# Altium schematic sheet MCU.SchDoc
size A3; SheetNumber: 3; SheetTotal: 7
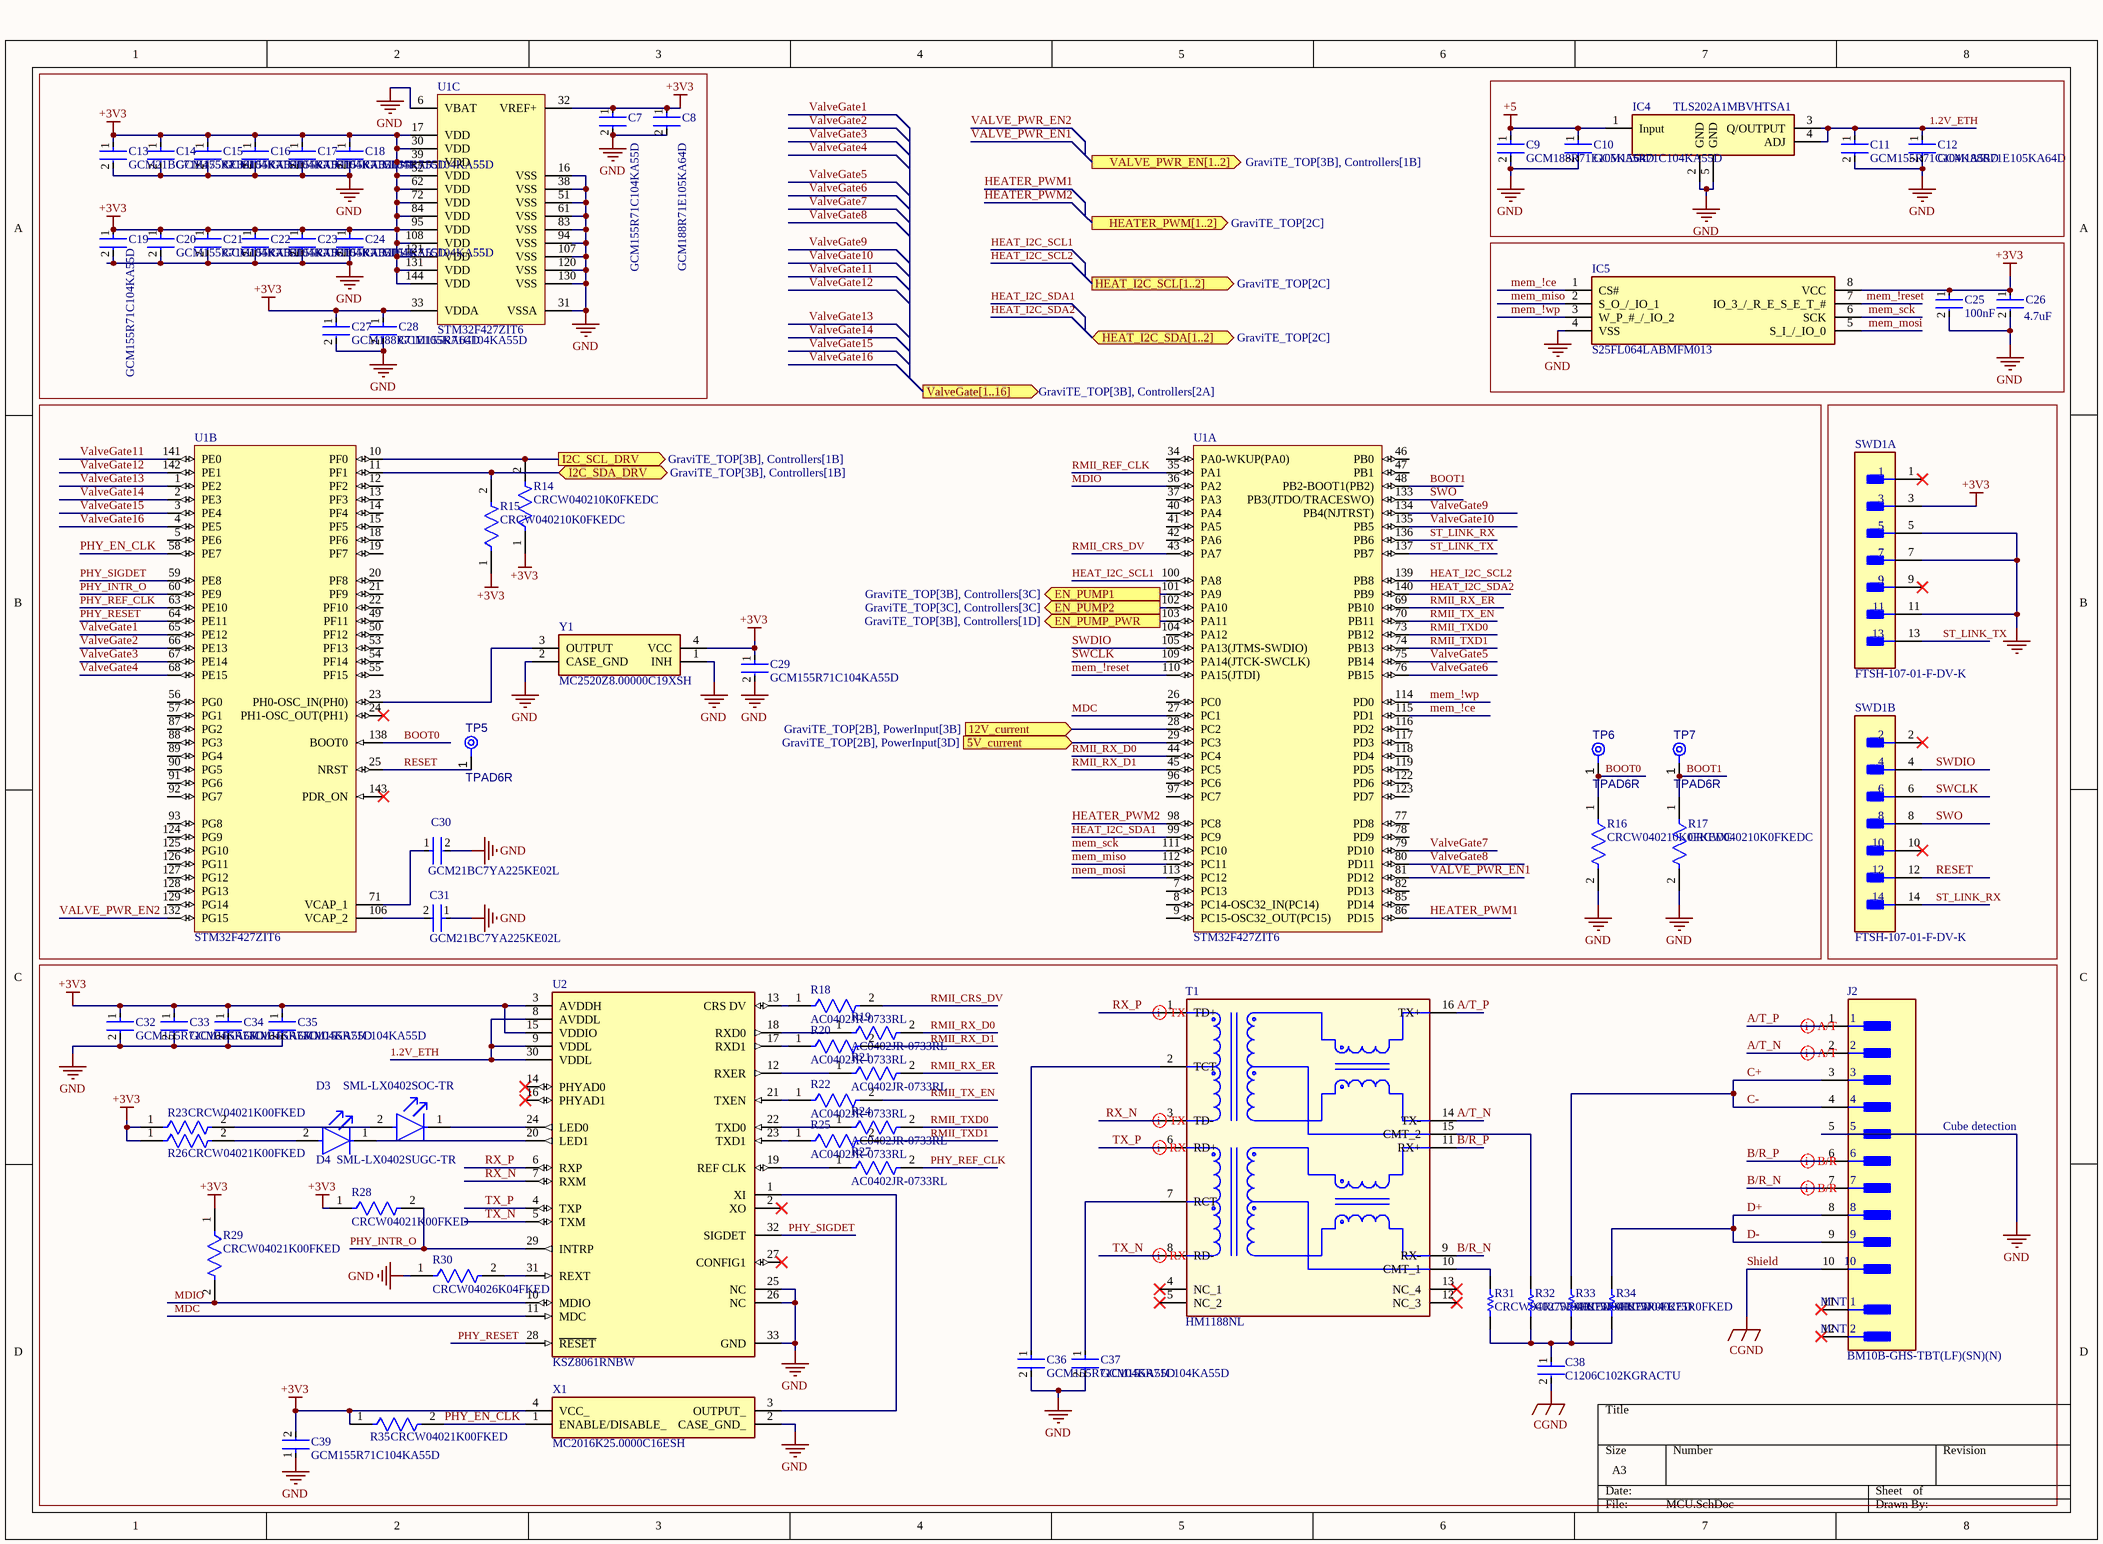
[diagram p0: MCU.SchDoc]

## Parts
C7  GCM155R71C104KA55D  [FP-GCM155-0_05-IPC_C]
C8  GCM188R71E105KA64D  [FP-GCM188-0_1-MFG]
C9  GCM188R71E105KA64D  [FP-GCM188-0_1-MFG]
C10  GCM155R71C104KA55D  [FP-GCM155-0_05-IPC_C]
C11  GCM155R71C104KA55D  [FP-GCM155-0_05-IPC_C]
C12  GCM188R71E105KA64D  [FP-GCM188-0_1-MFG]
C13  GCM21BC71E475KE36L  [FP-GCM21B-0_2-e0_2_0_7-IPC_C]
C14  GCM155R71C104KA55D  [FP-GCM155-0_05-IPC_C]
C15  GCM155R71C104KA55D  [FP-GCM155-0_05-IPC_C]
C16  GCM155R71C104KA55D  [FP-GCM155-0_05-IPC_C]
C17  GCM155R71C104KA55D  [FP-GCM155-0_05-IPC_C]
C18  GCM155R71C104KA55D  [FP-GCM155-0_05-IPC_C]
C19  GCM155R71C104KA55D  [FP-GCM155-0_05-IPC_C]
C20  GCM155R71C104KA55D  [FP-GCM155-0_05-IPC_C]
C21  GCM155R71C104KA55D  [FP-GCM155-0_05-IPC_C]
C22  GCM155R71C104KA55D  [FP-GCM155-0_05-IPC_C]
C23  GCM155R71C104KA55D  [FP-GCM155-0_05-IPC_C]
C24  GCM155R71C104KA55D  [FP-GCM155-0_05-IPC_C]
C25  100nF  [FP-GCM155-0_05-IPC_C]
C26  4.7uF  [FP-GCM21B-0_2-e0_2_0_7-IPC_C]
C27  GCM188R71E105KA64D  [FP-GCM188-0_1-MFG]
C28  GCM155R71C104KA55D  [FP-GCM155-0_05-IPC_C]
C29  GCM155R71C104KA55D  [FP-GCM155-0_05-IPC_C]
C30  GCM21BC7YA225KE02L  [FP-GCM21B-0_15-MFG]
C31  GCM21BC7YA225KE02L  [FP-GCM21B-0_15-MFG]
C32  GCM155R71C104KA55D  [FP-GCM155-0_05-IPC_C]
C33  GCM155R71C104KA55D  [FP-GCM155-0_05-IPC_C]
C34  GCM155R71C104KA55D  [FP-GCM155-0_05-IPC_C]
C35  GCM155R71C104KA55D  [FP-GCM155-0_05-IPC_C]
C36  GCM155R71C104KA55D  [FP-GCM155-0_05-IPC_C]
C37  GCM155R71C104KA55D  [FP-GCM155-0_05-IPC_C]
C38  C1206C102KGRACTU  [FP-C1206C-EF-MFG]
C39  GCM155R71C104KA55D  [FP-GCM155-0_05-IPC_C]
D3  SML-LX0402SOC-TR  [FP-SML-LX0402SOC-TR-MFG]
D4  SML-LX0402SUGC-TR  [FP-SML-LX0402SUGC-TR-MFG]
IC4  TLS202A1MBVHTSA1  [TLS202A1MBVHTSA1]
IC5  S25FL064LABMFM013  [SOIC127P800X216-8N]
J2  BM10B-GHS-TBT(LF)(SN)(N)  [FP-BM10B-GHS-TBT_LF_SN-MFG]
R14  CRCW040210K0FKEDC  [FP-CRCW0402-C-e3-IPC_C]
R15  CRCW040210K0FKEDC  [FP-CRCW0402-C-e3-IPC_C]
R16  CRCW040210K0FKEDC  [FP-CRCW0402-C-e3-IPC_C]
R17  CRCW040210K0FKEDC  [FP-CRCW0402-C-e3-IPC_C]
R18  AC0402JR-0733RL  [FP-AC0402-IPC_B]
R19  AC0402JR-0733RL  [FP-AC0402-IPC_B]
R20  AC0402JR-0733RL  [FP-AC0402-IPC_B]
R21  AC0402JR-0733RL  [FP-AC0402-IPC_B]
R22  AC0402JR-0733RL  [FP-AC0402-IPC_B]
R23  CRCW04021K00FKED  [FP-CRCW0402-e3-MFG]
R24  AC0402JR-0733RL  [FP-AC0402-IPC_B]
R25  AC0402JR-0733RL  [FP-AC0402-IPC_B]
R26  CRCW04021K00FKED  [FP-CRCW0402-e3-MFG]
R27  AC0402JR-0733RL  [FP-AC0402-IPC_B]
R28  CRCW04021K00FKED  [FP-CRCW0402-e3-MFG]
R29  CRCW04021K00FKED  [FP-CRCW0402-e3-MFG]
R30  CRCW04026K04FKED  [FP-CRCW0402-e3-IPC_A]
R31  CRCW040275R0FKED  [RESC1005X40X25NL05T05]
R32  CRCW040275R0FKED  [RESC1005X40X25NL05T05]
R33  CRCW040275R0FKED  [RESC1005X40X25NL05T05]
R34  CRCW040275R0FKED  [RESC1005X40X25NL05T05]
R35  CRCW04021K00FKED  [FP-CRCW0402-e3-MFG]
SWD1  FTSH-107-01-F-DV-K  [FP-FTSH-107-01-F-DV-K-MFG]  (parts A,B of 2)
T1  HM1188NL  [HM1188NL]
TP5  TPAD6R  [TP06R]  (no BOM)
TP6  TPAD6R  [TP06R]  (no BOM)
TP7  TPAD6R  [TP06R]  (no BOM)
U1  STM32F427ZIT6  [STM-LQFP144_V]  (parts A,B,C of 3)
U2  KSZ8061RNBW  [FP-QFN55-32LD-PL-5-IPC_A]
X1  MC2016K25.0000C16ESH  [MC2016K250000C16ESH]
Y1  MC2520Z8.00000C19XSH  [MC2520Z800000C19XSH]

## Blocks framed on the sheet
Cube detection: C32-C39 D3 D4 J2 R18-R35 T1 U2 X1

## Ports
5V_current (in, see GraviTE_TOP[2B], PowerInput[3D]), 12V_current (in, see GraviTE_TOP[2B], PowerInput[3B]), EN_PUMP1 (out, see GraviTE_TOP[3B], Controllers[3C]), EN_PUMP2 (out, see GraviTE_TOP[3C], Controllers[3C]), EN_PUMP_PWR (out, see GraviTE_TOP[3B], Controllers[1D]), HEAT_I2C_SCL[1..2] (out, see GraviTE_TOP[2C]), HEAT_I2C_SDA[1..2] (bidir, see GraviTE_TOP[2C]), HEATER_PWM[1..2] (out, see GraviTE_TOP[2C]), I2C_SCL_DRV (out, see GraviTE_TOP[3B], Controllers[1B]), I2C_SDA_DRV (bidir, see GraviTE_TOP[3B], Controllers[1B]), VALVE_PWR_EN[1..2] (out, see GraviTE_TOP[3B], Controllers[1B]), ValveGate[1..16] (out, see GraviTE_TOP[3B], Controllers[2A])

## Nets
+3V3: C7.1 C8.1 C13.1 C14.1 C15.1 C16.1 C17.1 C18.1 C19.1 C20.1 C21.1 C22.1 C23.1 C24.1 C25.1 C26.1 C27.1 C28.1 C29.1 C32.1 C33.1 C34.1 C35.1 C39.2 IC5.8(VCC) R14.1 R15.1 R23.1 R26.1 R28.1 R29.1 R35.1 SWD1.3 U1.17(VDD) U1.30(VDD) U1.32(VREF+) U1.33(VDDA) U1.39(VDD) U1.52(VDD) U1.62(VDD) U1.72(VDD) U1.84(VDD) U1.95(VDD) U1.108(VDD) U1.121(VDD) U1.131(VDD) U1.144(VDD) U2.3(AVDDH) U2.15(VDDIO) X1.4(VCC_) Y1.4(VCC)
+5: C9.1 C10.1 IC4.1(Input)
GND: C7.2 C8.2 C9.2 C10.2 C11.2 C12.2 C13.2 C14.2 C15.2 C16.2 C17.2 C18.2 C19.2 C20.2 C21.2 C22.2 C23.2 C24.2 C25.2 C26.2 C27.2 C28.2 C29.2 C30.2 C31.1 C32.2 C33.2 C34.2 C35.2 C36.2 C37.2 C39.1 IC4.2(GND) IC4.5(GND) IC5.4(VSS) J2.5 R16.2 R17.2 R30.1 SWD1.5 SWD1.7 SWD1.11 U1.6(VBAT) U1.16(VSS) U1.31(VSSA) U1.38(VSS) U1.51(VSS) U1.61(VSS) U1.83(VSS) U1.94(VSS) U1.107(VSS) U1.120(VSS) U1.130(VSS) U2.25(NC) U2.26(NC) U2.33(GND) X1.2(CASE_GND_) Y1.1(INH) Y1.2(CASE_GND)
Shield: C38.2 J2.10  [also labelled CGND]
1.2V_ETH: C11.1 C12.1 IC4.3(Q/OUTPUT) IC4.4(ADJ) U2.8(AVDDL) U2.9(VDDL) U2.30(VDDL)
5V_current: U1.29(PC3) ; port 5V_current
12V_current: U1.28(PC2) ; port 12V_current
A/T_N: J2.2 T1.14(TX-)
A/T_P: J2.1 T1.16(TX+)
B/R_N: J2.7 T1.9(RX-)
B/R_P: J2.6 T1.11(RX+)
BOOT0: R16.1 TP6.1(TP) U1.138(BOOT0)
BOOT1: R17.1 TP7.1(TP) U1.48(PB2-BOOT1(PB2))
C+: J2.3 J2.4 R33.2  [also labelled C-]
D+: J2.8 J2.9 R34.2  [also labelled D-]
EN_PUMP1: U1.101(PA9) ; port EN_PUMP1
EN_PUMP2: U1.102(PA10) ; port EN_PUMP2
EN_PUMP_PWR: U1.103(PA11) ; port EN_PUMP_PWR
HEAT_I2C_SCL1: U1.100(PA8)
HEAT_I2C_SCL2: U1.139(PB8)
HEAT_I2C_SDA1: U1.99(PC9)
HEAT_I2C_SDA2: U1.140(PB9)
HEATER_PWM1: U1.86(PD15)
HEATER_PWM2: U1.98(PC8)
I2C_SCL_DRV: R14.2 U1.10(PF0) ; port I2C_SCL_DRV
I2C_SDA_DRV: R15.2 U1.11(PF1) ; port I2C_SDA_DRV
MDC: U1.27(PC1) U2.11(MDC)
MDIO: R29.2 U1.36(PA2) U2.10(MDIO)
mem_!ce: IC5.1(CS#) U1.115(PD1)
mem_!reset: IC5.7(IO_3_/_R_E_S_E_T_#) U1.110(PA15(JTDI))
mem_!wp: IC5.3(W_P_#_/_IO_2) U1.114(PD0)
mem_miso: IC5.2(S_O_/_IO_1) U1.112(PC11)
mem_mosi: IC5.5(S_I_/_IO_0) U1.113(PC12)
mem_sck: IC5.6(SCK) U1.111(PC10)
PHY_EN_CLK: R35.2 U1.58(PE7) X1.1(ENABLE/DISABLE_)
PHY_INTR_O: R28.2 U1.60(PE9) U2.29(INTRP)
PHY_REF_CLK: R27.2 U1.63(PE10)
PHY_RESET: U1.64(PE11) U2.28(~{RESET})
PHY_SIGDET: U1.59(PE8) U2.32(SIGDET)
RESET: SWD1.12 TP5.1(TP) U1.25(NRST)
RMII_CRS_DV: R18.2 U1.43(PA7)
RMII_REF_CLK: U1.35(PA1)
RMII_RX_D0: R19.2 U1.44(PC4)
RMII_RX_D1: R20.2 U1.45(PC5)
RMII_RX_ER: R21.2 U1.69(PB10)
RMII_TX_EN: R22.2 U1.70(PB11)
RMII_TXD0: R24.2 U1.73(PB12)
RMII_TXD1: R25.2 U1.74(PB13)
RX_N: T1.3(TD-) U2.7(RXM)
RX_P: T1.1(TD+) U2.6(RXP)
ST_LINK_RX: SWD1.14 U1.136(PB6)
ST_LINK_TX: SWD1.13 U1.137(PB7)
SWCLK: SWD1.6 U1.109(PA14(JTCK-SWCLK))
SWDIO: SWD1.4 U1.105(PA13(JTMS-SWDIO))
SWO: SWD1.8 U1.133(PB3(JTDO/TRACESWO))
TX_N: T1.8(RD-) U2.5(TXM)
TX_P: T1.6(RD+) U2.4(TXP)
VALVE_PWR_EN1: U1.81(PD12)
VALVE_PWR_EN2: U1.132(PG15)
ValveGate1: U1.65(PE12)
ValveGate2: U1.66(PE13)
ValveGate3: U1.67(PE14)
ValveGate4: U1.68(PE15)
ValveGate5: U1.75(PB14)
ValveGate6: U1.76(PB15)
ValveGate7: U1.79(PD10)
ValveGate8: U1.80(PD11)
ValveGate9: U1.134(PB4(NJTRST))
ValveGate10: U1.135(PB5)
ValveGate11: U1.141(PE0)
ValveGate12: U1.142(PE1)
ValveGate13: U1.1(PE2)
ValveGate14: U1.2(PE3)
ValveGate15: U1.3(PE4)
ValveGate16: U1.4(PE5)
NetC30_1: C30.1 U1.71(VCAP_1)
NetC31_2: C31.2 U1.106(VCAP_2)
NetC36_1: C36.1 T1.2(TCT)
NetC37_1: C37.1 T1.7(RCT)
NetC38_1: C38.1 R31.1 R32.1 R33.1 R34.1
NetD3_1: D3.1(C) U2.24(LED0)
NetD3_2: D3.2(A) R23.2
NetD4_1: D4.1(C) U2.20(LED1)
NetD4_2: D4.2(A) R26.2
NetR18_1: R18.1 U2.13(CRS_DV)
NetR19_1: R19.1 U2.18(RXD0)
NetR20_1: R20.1 U2.17(RXD1)
NetR21_1: R21.1 U2.12(RXER)
NetR22_1: R22.1 U2.21(TXEN)
NetR24_1: R24.1 U2.22(TXD0)
NetR25_1: R25.1 U2.23(TXD1)
NetR27_1: R27.1 U2.19(REF_CLK)
NetR30_2: R30.2 U2.31(REXT)
NetR31_2: R31.2 T1.10(CMT_1)
NetR32_2: R32.2 T1.15(CMT_2)
NetU1_23: U1.23(PH0-OSC_IN(PH0)) Y1.3(OUTPUT)
NetU2_1: U2.1(XI) X1.3(OUTPUT_)

Not connected (* = marked no-connect by the designer): J2 11(MNT_1)* 12(MNT_2)*; SWD1 1* 2* 9* 10*; T1 4(NC_1)* 5(NC_2)* 12(NC_3)* 13(NC_4)*; U1 5(PE6) 7(PC13) 8(PC14-OSC32_IN(PC14)) 9(PC15-OSC32_OUT(PC15)) 12(PF2) 13(PF3) 14(PF4) 15(PF5) 18(PF6) 19(PF7) 20(PF8) 21(PF9) 22(PF10) 24(PH1-OSC_OUT(PH1))* 26(PC0) 34(PA0-WKUP(PA0)) 37(PA3) 40(PA4) 41(PA5) 42(PA6) 46(PB0) 47(PB1) 49(PF11) 50(PF12) 53(PF13) 54(PF14) 55(PF15) 56(PG0) 57(PG1) 77(PD8) 78(PD9) 82(PD13) 85(PD14) 87(PG2) 88(PG3) 89(PG4) 90(PG5) 91(PG6) 92(PG7) 93(PG8) 96(PC6) 97(PC7) 104(PA12) 116(PD2) 117(PD3) 118(PD4) 119(PD5) 122(PD6) 123(PD7) 124(PG9) 125(PG10) 126(PG11) 127(PG12) 128(PG13) 129(PG14) 143(PDR_ON)*; U2 2(XO)* 14(PHYAD0)* 16(PHYAD1)* 27(CONFIG1)*

## Layout directives
differential pair: A/T_N, A/T_P, B/R_N, B/R_P, RX_N, RX_P, TX_N, TX_P

## Library data of the parts
C7 C10 C11 C14-C25 C28 C29 C32-C37 C39 = CMP-2008-03711-3: Ceramic Capacitor for Automotive 100nF ±10% 16VDC X7R 0402 Paper T/R; Voltage Rating (DC): 16V; Termination: SMD/SMT; Length: 1mm; Voltage: 16V; Mount: Surface Mount; Packaging: Tape and Reel; Case Code (Metric): 1005; Case/Package: 0402; Voltage Rating: 16V; Min Operating Temperature: -55°C; Case Code (Imperial): 0402; Ratings: AEC-Q200; Height: 0.5mm; Tolerance: 10%; Width: 0.02inch; Radiation Hardening: No; Depth: 0.5mm; Capacitance: 100nF; Max Operating Temperature: 125°C; Package Quantity: 1; REACH SVHC: No SVHC; Thickness: 0.022inch; Dielectric: X7R; Lead Free: Lead Free
C8 C9 C12 C27 = CMP-2006-02363-4: Manufacturer Lifecycle Status: IN PRODUCTION; NexarPartId: 18909256; Dielectric: X7R; Material: Ceramic; Tolerance: 10%; Capacitance: 1µF; Voltage Rating: 25V; Thickness: 889µm; Max Operating Temperature: 125°C; Radiation Hardening: No; Weight: 6.293594mg; Lead Free: Lead Free; Mount: Surface Mount; Case Code (Imperial): 0603; REACH SVHC: No SVHC; Lifecycle Status: Production; Depth: 800µm; Min Operating Temperature: -55°C; Height: 800µm; Case Code (Metric): 1608; Case/Package: 0603; Voltage: 25V; Packaging: Cut Tape; Length: 1.6mm; Termination: SMD/SMT; Width: 787.4µm; Voltage Rating (DC): 25V; RoHS: Compliant; Schedule B: 8532240020, 8532240020; Ratings: AEC-Q200
C13 C26 = CMP-06035-049372-1: Ceramic Capacitor for Automotive 4.7uF ±10% 25VDC X7S 0805 Embossed T/R; Voltage Rating: 25V; Mount: Surface Mount; Case/Package: 0805; Case Code (Imperial): 0805; Tolerance: 10%; Max Operating Temperature: 125°C; Capacitance: 4.7uF; Packaging: Cut Tape; Min Operating Temperature: -55°C; Ratings: AEC-Q200; Case Code (Metric): 2012
C30 C31 = CMP-06035-026512-1: Ceramic Capacitor for Automotive 2.2uF ±10% 35VDC X7S 0805 Embossed T/R; Voltage Rating: 35V; Capacitance: 2.2uF; Case Code (Metric): 2012; Max Operating Temperature: 125°C; Min Operating Temperature: -55°C; Case Code (Imperial): 0805; Ratings: AEC-Q200; Packaging: Cut Tape; Mount: Surface Mount; Tolerance: 10%; Case/Package: 0805
C38 = CMP-03020-034681-1: CAP CER 1000PF 2KV X7R 1206; Tolerance: 10%; Capacitance: 1nF; Dissipation Factor: 2.5%; Dielectric Material: Ceramic; Voltage Rating (DC): 2.5kV; Voltage: 2kV; REACH SVHC: No SVHC; Height: 1.6mm; Construction: Flat; Case/Package: 1206; Series: C; Mount: Surface Mount; RoHS Compliant: Yes; Package Quantity: 1; Length: 3.2mm; Width: 0.063inch; Voltage Rating: 2kV; Min Operating Temperature: -55°C; Case Code (Metric): 3216; Termination: SMD/SMT; Number of Pins: 2; Case Code (Imperial): 1206; Packaging: Tape and Reel; Dielectric: X7R; Thickness: 0.069inch; Depth: 1.6mm; Radiation Hardening: No; Max Operating Temperature: 125°C
D3 = CMP-57192-000002-1: LED ORANGE CLEAR SMD; Forward Voltage: 2V; Viewing Angle: 120°; Luminous Intensity: 120mcd; Wavelength: 610nm; Forward Current: 20mA; Number of LEDs: 1; Lens Color: Colorless; Max Operating Temperature: 85°C; Mount: Surface Mount; Lens Transparency: Clear; Lens Style: Clear; Case Code (Metric): 1005; Length: 1mm; Package Quantity: 1; Case Code (Imperial): 0402; Color: Orange; Illumination Color: Orange; Width: 0.5mm; Packaging: Tape and Reel; Test Current: 20mA; Min Operating Temperature: -40°C; Height: 0.5mm; Number of Pins: 2; Lead Free: Lead Free; Case/Package: 0402
D4 = CMP-57192-000001-1: LED GREEN CLEAR SMD; Forward Voltage: 2.2V; Test Current: 20mA; Luminous Intensity: 45mcd; Lens Style: Diffused; Number of LEDs: 1; Approvals: UL; Lens Color: Colorless; Dominant Wavelength: 574nm; Viewing Angle: 120°; Lead Free: Lead Free; Case/Package: 0402; Number of Pins: 2; Width: 0.5mm; Min Operating Temperature: -40°C; Case Code (Imperial): 0402; Packaging: Tape and Reel; Color: Green; Max Operating Temperature: 85°C; Case Code (Metric): 1005; Mount: Surface Mount; Length: 1mm; Wavelength: 574nm; Height: 0.5mm; Illumination Color: Green; Lens Transparency: Clear; Package Quantity: 1; Forward Current: 20mA
IC4 = TLS202A1MBVHTSA1: Integrated Circuit; Manufacturer_Name: Infineon; Datasheet Link: https://www.infineon.com/dgdl/Infineon-TLS202A1MBV-DS-v01_00-EN.pdf?fileId=5546d46258fc0bc1015969d30cbf4211; Manufacturer_Part_Number: TLS202A1MBVHTSA1; Mouser Part Number: 726-TLS202A1MBVHTSA1; Mouser Price/Stock: https://www.mouser.co.uk/ProductDetail/Infineon-Technologies/TLS202A1MBVHTSA1?qs=0DP5yvOrqYl%252BugsjRWokhA%3D%3D
IC5 = S25FL064LABMFM013: Integrated Circuit; Manufacturer_Name: Infineon; Datasheet Link: https://www.arrow.com/en/products/s25fl064labmfm013/cypress-semiconductor; Height: 2.16mm; Manufacturer_Part_Number: S25FL064LABMFM013; Mouser Part Number: 727-S25FL064LAMFM013; Mouser Price/Stock: https://www.mouser.co.uk/ProductDetail/Infineon-Technologies/S25FL064LABMFM013?qs=HXFqYaX1Q2wJ3%252BtVnB80Jw%3D%3D; Arrow Part Number: S25FL064LABMFM013; Arrow Price/Stock: https://www.arrow.com/en/products/s25fl064labmfm013/cypress-semiconductor
J2 = CMP-17439-000269-1: CONN HEADER SMD 10POS 1.25MM; Mated Stacking Heights: 7.3mm; Number of Positions: 10; Voltage Rating: 50V; Packaging: Cut Tape; Contact Shape: Rectangular; Insulation Material: Nylon; Contact Type: Outer Shroud Contact; Contact Finish - Mating: TIN; Fastening Type: Ramp; Termination: Solder; Max Operating Temperature: 85°C; Min Operating Temperature: -25°C; Insulation Color: Natural; Number of Rows: 1; Flammability Rating: UL94 V-0; Contact Material: Bronze; Mount: Surface Mount; Series: GH; Connector Type: Header
R14-R17 = CMP-02407-012085-1: RES 10K OHM 1% 1/16W 0402; Temperature Coefficient: 100ppm/°C; Power Rating: 62.5mW; Resistance: 10kR; Lead Free: Lead Free; Max Operating Temperature: 155°C; RoHS Compliant: Yes; Mount: Surface Mount; Min Operating Temperature: -55°C; Termination: Wraparound; Length: 1mm; Resistor Type: Thick Film; Contact Plating: Tin; Tolerance: 1%; Case/Package: Molded
R18-R22 R24 R25 R27 = CMP-03412-045460-1: RES 33Ω ±5% 0.063W 0402; Resistance: 33R; Voltage Rating: 50V; Power Rating: 62.5mW; Temperature Coefficient: 100ppm/°C; Max Power Dissipation: 63mW; Width: 0.5mm; Max Operating Temperature: 155°C; Termination: SMD/SMT; Size Code: 0402; Lead Free: Lead Free; Series: AC; Case Code (Imperial): 0402; RoHS Compliant: Yes; Packaging: Tape and Reel; Features: Moisture Resistant; Case/Package: 0402; Height: 0.015inch; Length: 0.039inch; Number of Terminations: 2; Case Code (Metric): 1005; Tolerance: 5%; Min Operating Temperature: -55°C; Weight: 2.3E-05oz; Resistor Type: Thick Film
R23 R26 R28 R29 R35 = CMP-2002-08276-2: RES Thick Film, 1kΩ, 1%, 0.063W, 100ppm/°C, 0402; Resistance: 1kR; Power Rating: 63mW; Voltage Rating (DC): 50V; Package Quantity: 10; Termination: SMD/SMT; Width: 0.5mm; Military Standard: Not; Length: 1mm; Contact Plating: Tin; Mount: Surface Mount; Packaging: Tape and Reel; Case Code (Imperial): 0402; Tolerance: 1%; Weight: 2.3E-05oz; Number of Pins: 2; Case/Package: 0402; Case Code (Metric): 1005; Lead Free: Lead Free; Number of Terminations: 2; Max Power Dissipation: 63mW; Depth: 0.5mm; Temperature Coefficient: 100ppm/°C; Max Operating Temperature: 155°C; Height: 0.35mm; Features: Automotive AEC-Q200; Composition: Thick Film; Radiation Hardening: No; Voltage Rating: 50V; Min Operating Temperature: -55°C
R30 = CMP-1011-00598-3: RES Thick Film, 6.04kΩ, 1%, 0.063W, 100ppm/°C, 0402; Voltage Rating: 50V; Max Power Dissipation: 63mW; Resistance: 6.04kR; Number of Terminations: 2; Features: Automotive AEC-Q200; Lead Free: Lead Free; Radiation Hardening: No; Case/Package: 0402; Depth: 0.5mm; Composition: Thick Film; Length: 1mm; Width: 0.02inch; Temperature Coefficient: 100ppm/°C; Min Operating Temperature: -55°C; Voltage Rating (DC): 50V; Contact Plating: Tin; Military Standard: Not; Package Quantity: 10; Case Code (Imperial): 0402; Weight: 2.3E-05oz; Tolerance: 1%; Power Rating: 63mW; Max Operating Temperature: 155°C; Packaging: Tape and Reel; Number of Pins: 2; Height: 0.35mm; Termination: SMD/SMT; Case Code (Metric): 1005
R31-R34 = CMP-2002-00210-1: Manufacturer: Vishay Dale; Part Number: CRCW040275R0FKED
SWD1 = CMP-02766-001448-1: CONN HEADER SMD 14POS 1.27MM; Gender: Male; Connector Type: Male Pin; Number of Contacts: 14; Row Spacing: 0.05inch; Min Operating Temperature: -55°C; Package Quantity: 1; Lead Free: Lead Free; RoHS Compliant: Yes; Contact Material: Bronze; Contact Plating: Gold; Number of Rows: 2; Housing Material: Polymer; Contact Type: Male Pin; Series: FTSH; Max Operating Temperature: 125°C; Orientation: Straight; Number of Positions: 14; Pitch: 1.27mm; Housing Color: Black; Color: Black; Radiation Hardening: No; Length: 8.89mm; Termination: Solder; Packaging: Rail/Tube; Depth: 5.84mm; Mount: Surface Mount; Contact Mating Length: 0.12inch
T1 = HM1188NL: Transformer; Manufacturer_Name: Pulse Electronics; Datasheet Link: https://componentsearchengine.com/Datasheets/1/HM1188NL.pdf; Height: 5.969mm; Manufacturer_Part_Number: HM1188NL; Mouser Part Number: 673-HM1188NL; Mouser Price/Stock: https://www.mouser.co.uk/ProductDetail/Pulse-Electronics/HM1188NL?qs=IbBl3rwNelMAAot5OPq3lA%3D%3D; Arrow Part Number: HM1188NL; Arrow Price/Stock: https://www.arrow.com/en/products/hm1188nl/pulse-electronics-corporation?region=nac
TP5-TP7 = CMP-00028-00002-2: 0.6mm round; Pins: 1
U1 = CMP-0243-00053-2: ARM Cortex-M4 32-bit MCU+FPU, 210 DMIPS, 2048 kB Flash, 256 kB Internal RAM, 114 I/Os, 144-pin LQFP, -40 to 85 degC, Tray; Manufacturer: STMicroelectronics; I/Os (High Current): 114; Operating Frequency(F) (Processor speed) (MHz): 168; Supply Voltage(Vcc) max (V): 3.6; FLASH Size (Prog) (kB): 2048; Internal RAM Size (kB): 256; D/A Converter: 2x12-bit; Supply Voltage(Vcc) min (V): 1.8; PartNumber: STM32F427ZIT6; PackageReference: LQFP144; ComponentLink2Description: Datasheet; PackageVersion: Rev. 4, 06/2013; Core: ARM Cortex-M4; Mounting Technology: Surface Mount; ComponentLink3Description: Package Specification; PackageDescription: 144-Pin Low Profile Quad Flat Package, 20 x 20 mm Body, 0.5 mm Pitch; ComponentLink1Description: Manufacturer URL; ComponentLink2URL: http://www.st.com/st-web-ui/static/active/en/resource/technical/document/datasheet/DM00071990.pdf; ComponentLink3URL: http://www.st.com/st-web-ui/static/active/en/resource/technical/document/datasheet/DM00037051.pdf; Packing: Tray; ComponentLink1URL: http://www.st.com/web/en/home.html; DatasheetVersion: Rev. 1
U2 = CMP-06281-000125-1: IC TRANSCEIVER FULL 1/1 32QFN; Data Rate: 100Mbps; Min Supply Voltage: 1.14V; Simplex/Duplex: Full Duplex; Max Supply Voltage: 3.465V; Packaging: Tray; Mount: Surface Mount; Case/Package: QFN; Max Operating Temperature: 105°C; Number of Pins: 32; Series: -; RoHS Compliant: No; REACH SVHC: No SVHC; Min Operating Temperature: -40°C
X1 = MC2016K25.0000C16ESH: XTAL OSC XO 25.0000MHZ CMOS SMD; Manufacturer_Name: KYOCERA; Geometry.Height: 0.8mm; Mouser Part Number: 581-MC2016K25.C16ESH; Mouser Price/Stock: https://www.mouser.co.uk/ProductDetail/KYOCERA-AVX/MC2016K25.0000C16ESH?qs=yTuLhIm%2Fv1ApwYpapkX4jg%3D%3D; Manufacturer_Part_Number: MC2016K25.0000C16ESH; Datasheet Link: https://media.digikey.com/pdf/Data%20Sheets/AVX%20PDFs/MC2016K25.0000C16ESH_Spec~.pdf
Y1 = MC2520Z8.00000C19XSH: Crystal or Oscillator; Manufacturer_Name: Kyocera AVX; Datasheet Link: https://kr.mouser.com/datasheet/2/909/clock_mcz_xz_e-1845782.pdf; Height: 0.9mm; Manufacturer_Part_Number: MC2520Z8.00000C19XSH; Mouser Part Number: 346-MC2520Z8.00000C1; Mouser Price/Stock: https://www.mouser.co.uk/ProductDetail/Kyocera-Electronic-Components/MC2520Z800000C19XSH?qs=GBLSl2AkiruYmi3bsNLTwA%3D%3D